# EAGLE design xbee_adapter (EAGLE 5.06)
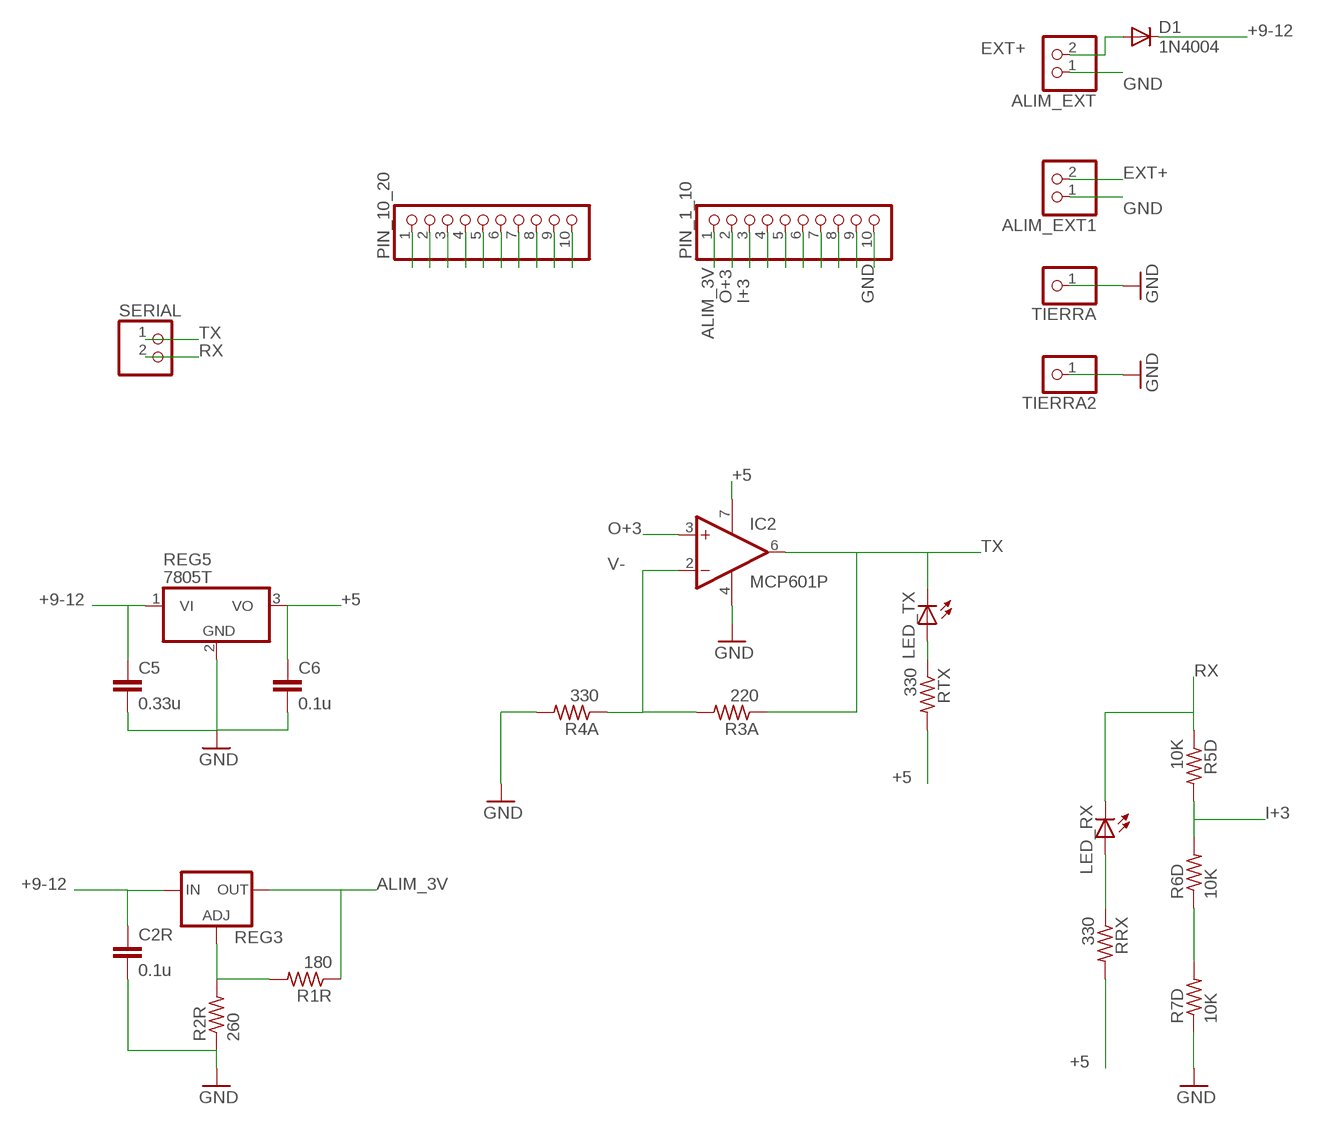
[diagram p0: schematic, sheet 1]

## Parts
ALIM_EXT  PINHD-1X2  [1X02]
ALIM_EXT1  PINHD-1X2  [1X02]
C2R  0.1u  C-EU025-024X044  [C025-024X044]
C5  0.33u  C-EU025-024X044  [C025-024X044]
C6  0.1u  C-EU025-024X044  [C025-024X044]
D1  1N4004  [DO41-10]
IC2  MCP601P  [DIL08]
LED_RX  LED3MM  [LED3MM]
LED_TX  LED3MM  [LED3MM]
PIN_1_10  PINHD-1X10  [1X10]
PIN_10_20  PINHD-1X10  [1X10]
R1R  180  R-US_0207/7  [0207/7]
R2R  260  R-US_0207/7  [0207/7]
R3A  220  R-US_0207/7  [0207/7]
R4A  330  R-US_0207/7  [0207/7]
R5D  10K  R-US_0207/7  [0207/7]
R6D  10K  R-US_0207/7  [0207/7]
R7D  10K  R-US_0207/7  [0207/7]
REG3  LM317TL  [317TL]
REG5  7805T  [TO220H]
RRX  330  R-US_0207/7  [0207/7]
RTX  330  R-US_0207/7  [0207/7]
SERIAL  PINHD-1X2  [1X02]
TIERRA  PINHD-1X1  [1X01]
TIERRA2  PINHD-1X1  [1X01]

## Nets
+5: C6.1 IC2.7(V+) REG5.3(VO) RRX.2 RTX.2
+9-12: C2R.1 C5.1 D1.C REG3.3(IN) REG5.1(VI)
ALIM_3V: PIN_1_10.1 R1R.1 REG3.2(OUT)
EXT+: ALIM_EXT1.2 ALIM_EXT.2 D1.A
GND: ALIM_EXT1.1 ALIM_EXT.1 C2R.2 C5.2 C6.2 IC2.4(V-) PIN_1_10.10 R2R.1 R4A.2 R7D.1 REG5.2(GND) TIERRA2.1 TIERRA.1
I+3: PIN_1_10.3 R5D.2 R6D.2
N$1: PIN_10_20.1
N$2: R1R.2 R2R.2 REG3.1(ADJ)
N$3: PIN_10_20.2
N$4: LED_TX.A RTX.1
N$5: PIN_10_20.3
N$6: R6D.1 R7D.2
N$7: PIN_10_20.4
N$8: PIN_10_20.5
N$9: PIN_10_20.6
N$10: PIN_10_20.7
N$11: PIN_10_20.8
N$12: PIN_10_20.9
N$13: PIN_10_20.10
N$15: LED_RX.A RRX.1
N$17: PIN_1_10.4
N$18: PIN_1_10.5
N$19: PIN_1_10.6
N$20: PIN_1_10.7
N$21: PIN_1_10.8
N$22: PIN_1_10.9
O+3: IC2.3(+IN) PIN_1_10.2
RX: LED_RX.K(C) R5D.1 SERIAL.2
TX: IC2.6(OUT) LED_TX.K(C) R3A.1 SERIAL.1
V-: IC2.2(-IN) R3A.2 R4A.1

## Library data of the parts
ALIM_EXT ALIM_EXT1 SERIAL = pinhead:PINHD-1X2: PIN HEADER
C2R C5 C6 = rcl:C-EU: CAPACITOR, European symbol
D1 = diode:1N4004: DIODE general purpose rectifier, 1 A
IC2 = linear:MCP601: Single Op Amp 2.7V to 6.0V Single Supply CMOS Source: http://ww1.microchip.com/downloads/en/DeviceDoc/21314g.pdf
LED_RX LED_TX = led:LED: LED OSRAM: - CHIPLED LG R971, LG N971, LY N971, LG Q971, LY Q971, LO R971, LY R971 LH N974, LH R974 LS Q976, LO Q976, LY Q976 LO Q996 - Hyper CHIPLED LW Q18S LB Q993, LB Q99A, LB R99A - SideLED LS A670, LO A670, LY A670, LG A670, LP A670 LB A673, LV A673, LT A673, LW A673 LH A674 LY A675 LS A676, LA A676, LO A676, LY A676, LW A676 LS A679, LY A679, LG A679 - Hyper Micro SIDELED® LS Y876, LA Y876, LO Y876, LY Y876 LT Y87S - SmartLED LW L88C, LW L88S LB L89C, LB L89S, LG L890 LS L89K, LO L89K, LY L89K LS L896, LA L896, LO L896, LY L896 - TOPLED LS T670, LO T670, LY T670, LG T670, LP T670 LSG T670, LSP T670, LSY T670, LOP T670, LYG T670 LG T671, LOG T671, LSG T671 LB T673, LV T673, LT T673, LW T673 LH T674 LS T676, LA T676, LO T676, LY T676, LB T676, LH T676, LSB T676, LW T676 LB T67C, LV T67C, LT T67C, LS T67K, LO T67K, LY T67K, LW E67C LS E67B, LA E67B, LO E67B, LY E67B, LB E67C, LV E67C, LT E67C LW T67C LS T679, LY T679, LG T679 LS T770, LO T770, LY T770, LG T770, LP T770 LB T773, LV T773, LT T773, LW T773 LH T774 LS E675, LA E675, LY E675, LS T675 LS T776, LA T776, LO T776, LY T776, LB T776 LHGB T686 LT T68C, LB T68C - Hyper Mini TOPLED® LB M676 - Mini TOPLED Santana® LG M470 LS M47K, LO M47K, LY M47K Source: http://www.osram.convergy.de LUXEON: - LUMILED® LXK2-PW12-R00, LXK2-PW12-S00, LXK2-PW14-U00, LXK2-PW14-V00 LXK2-PM12-R00, LXK2-PM12-S00, LXK2-PM14-U00 LXK2-PE12-Q00, LXK2-PE12-R00, LXK2-PE12-S00, LXK2-PE14-T00, LXK2-PE14-U00 LXK2-PB12-K00, LXK2-PB12-L00, LXK2-PB12-M00, LXK2-PB14-N00, LXK2-PB14-P00, LXK2-PB14-Q00 LXK2-PR12-L00, LXK2-PR12-M00, LXK2-PR14-Q00, LXK2-PR14-R00 LXK2-PD12-Q00, LXK2-PD12-R00, LXK2-PD12-S00 LXK2-PH12-R00, LXK2-PH12-S00 LXK2-PL12-P00, LXK2-PL12-Q00, LXK2-PL12-R00 Source: www.luxeon.com KINGBRIGHT: KA-3528ASYC Source: www.kingbright.com
PIN_1_10 PIN_10_20 = pinhead:PINHD-1X10: PIN HEADER
R1R R2R R3A R4A R5D R6D R7D RRX RTX = rcl:R-US_: RESISTOR, American symbol
REG3 = v-reg:LM317TL: VOLTAGE REGULATOR
REG5 = linear:78*: Positive VOLTAGE REGULATOR Source: http://cache.national.com/ds/LM/LM78L05.pdf http://www.fairchildsemi.com/ds/LM/LM7805.pdf
TIERRA TIERRA2 = pinhead:PINHD-1X1: PIN HEADER

## Board
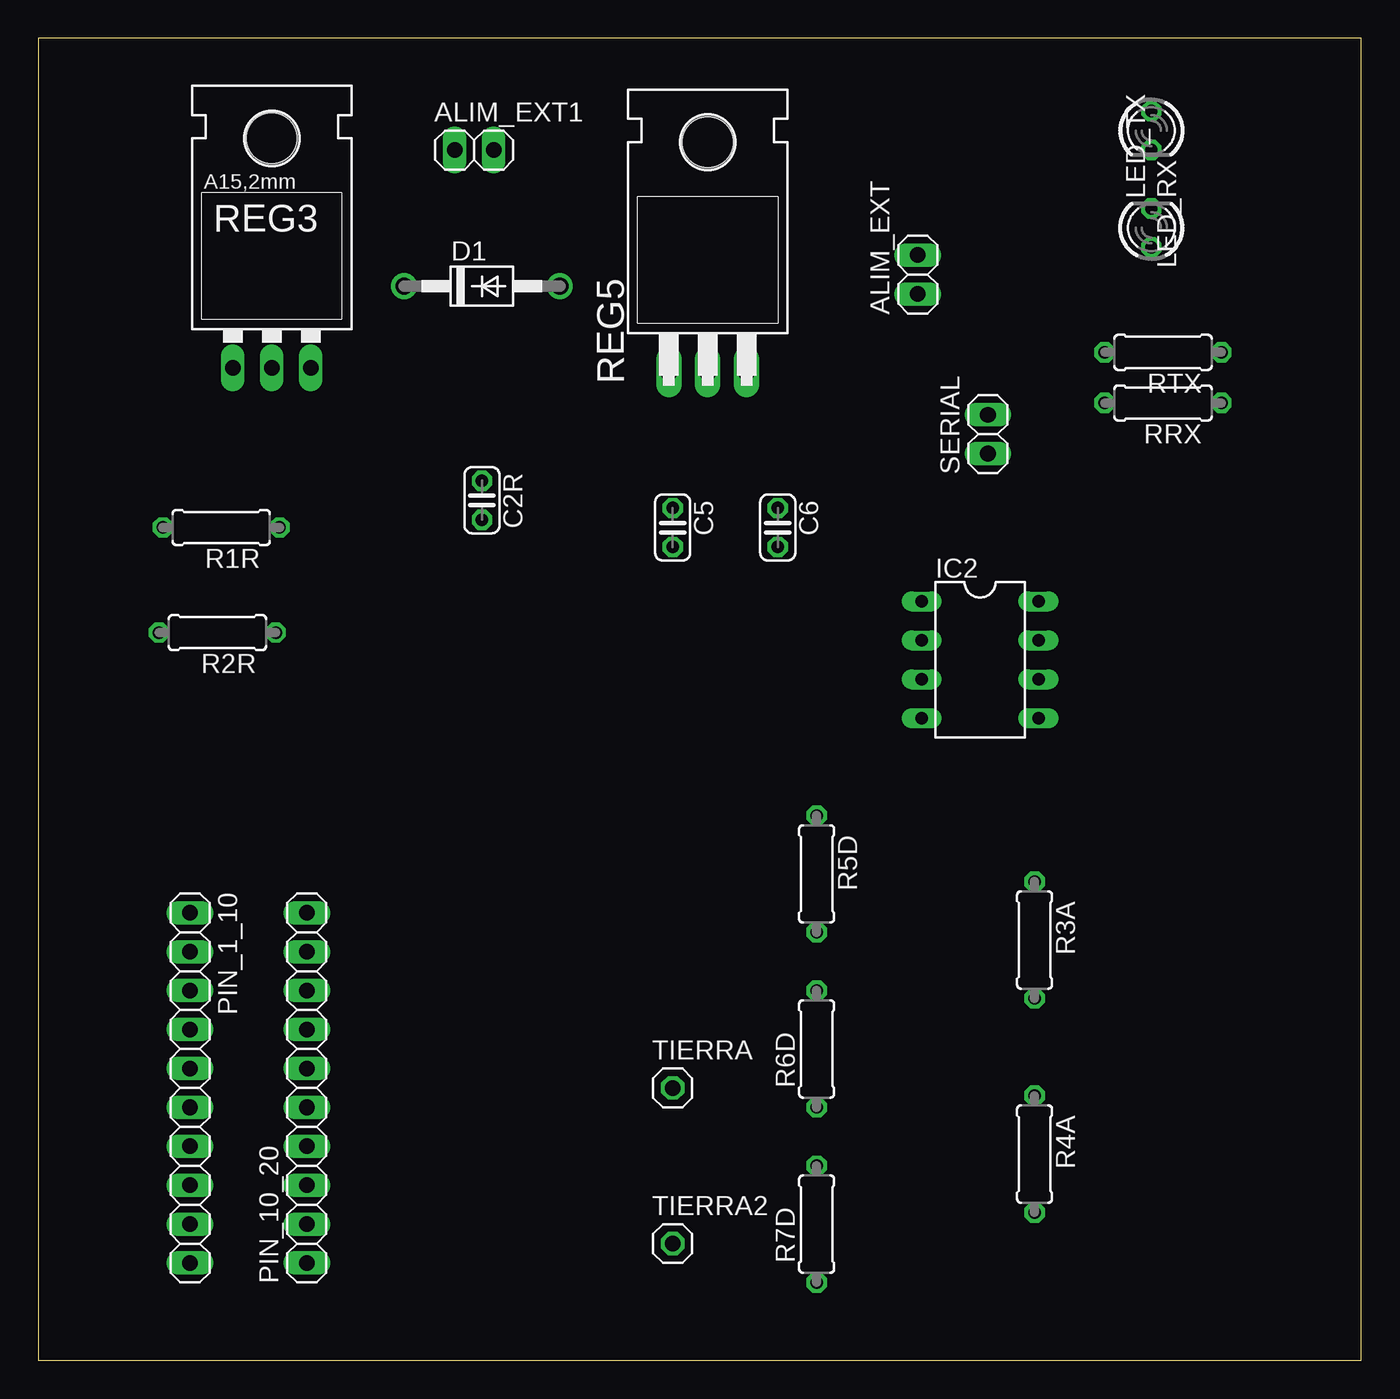
[diagram p1: board, top side]
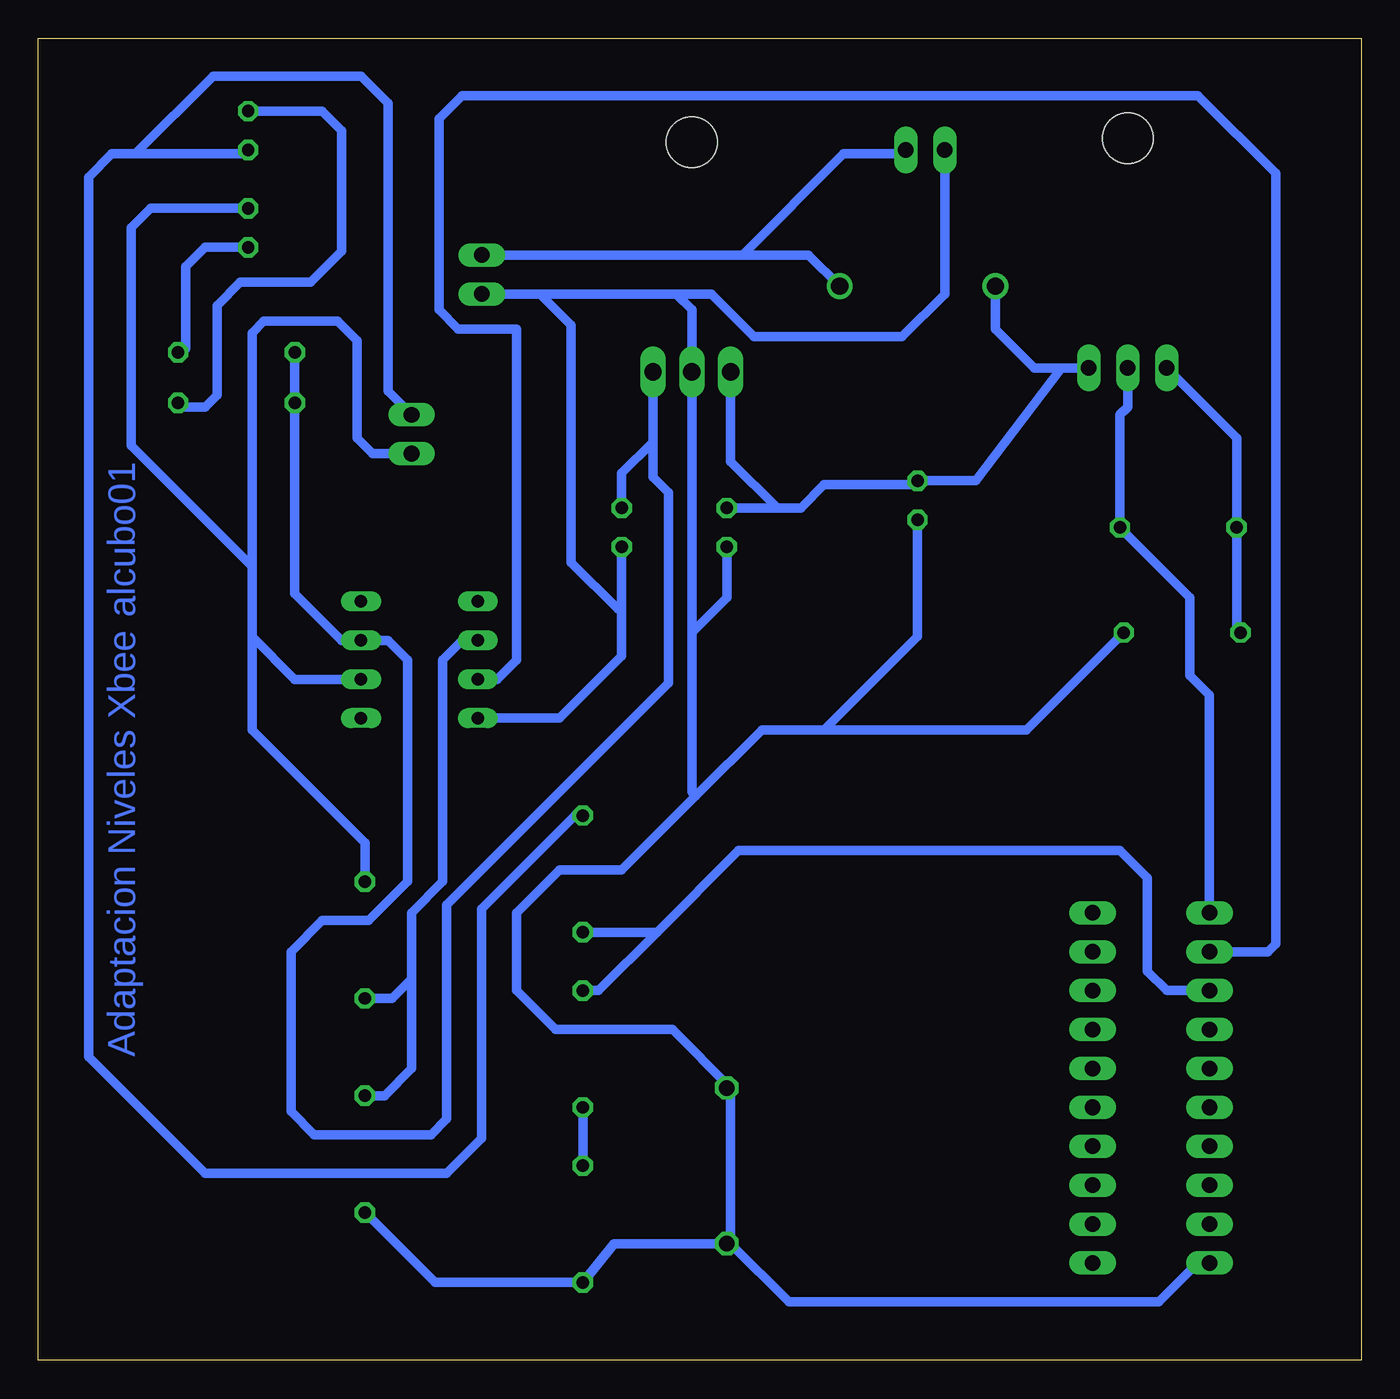
[diagram p2: board, bottom side, seen from below]

Size 86.34 x 86.28 mm. Coordinates in mm from the lower left corner, seen from the top.
Outline: 0,0 86.34,0 86.34,86.28 0,86.28 0,0
Copper layers (1*16): Top 0.035mm / dielectric 1.5mm / Bottom 0.035mm
Design rules "default *": minimum track width 24mil, minimum drill 24mil, track to track 20mil, track to pad 20mil, pad to pad 8mil, via to via 8mil, smd to smd 8mil, copper to edge 40mil, drill to drill 8mil, minimum pad ring 10mil, minimum via ring 8mil, stop-mask expansion 4mil, vias tented up to drill 0mil, thermal gap 10mil
bRestrict: area 16.3,27.4 to 19,28.4; area 27.9,55.6 to 30,56.6; area 40.4,53.8 to 42.4,54.9; area 47.2,53.8 to 49.3,54.9; area 16.3,24.9 to 19,25.9; area 16.3,22.4 to 19,23.4; area 16.3,19.8 to 19,20.8; area 16.3,17.3 to 19,18.3; area 16.3,14.7 to 19,15.7; area 16.3,12.2 to 19,13.2; area 16.3,9.7 to 19,10.7; area 8.6,27.4 to 11.4,28.4; 21 more areas

### Footprints (pad centres in the part's own frame; a part is rotated, then mirrored left to right if it is on the bottom)
1X02 = drill 1.016 long: 1 -1.27,0; 2 1.27,0
C025-024X044 = drill 0.813 octagon: 1 -1.27,0; 2 1.27,0
DO41-10 = drill 1.118 round: A 5.08,0; C -5.08,0
DIL08 = drill 0.813 long: 1 -3.81,-3.81; 2 -1.27,-3.81; 3 1.27,-3.81; 4 3.81,-3.81; 5 3.81,3.81; 6 1.27,3.81; 7 -1.27,3.81; 8 -3.81,3.81
LED3MM = drill 0.813 octagon: A -1.27,0; K 1.27,0
1X10 = drill 1.016 long: 1 -11.43,0; 2 -8.89,0; 3 -6.35,0; 4 -3.81,0; 5 -1.27,0; 6 1.27,0; 7 3.81,0; 8 6.35,0; 9 8.89,0; 10 11.43,0
0207/7 = drill 0.813 octagon: 1 -3.81,0; 2 3.81,0
317TL = drill 1.016 long: 1 -2.54,-3.81; 2 0,-3.81; 3 2.54,-3.81 | hole 3.302: 0,11.176
TO220H = drill 1.118 long: 1 -2.54,-10.16; 2 0,-10.16; 3 2.54,-10.16 | hole 3.302: 0,4.826
1X01 = drill 1.016 octagon: 1 0,0

### Placement (x,y rotation side)
ALIM_EXT  57.4,70.87 90 top
ALIM_EXT1  28.45,78.99 0 top
C2R  28.96,56.13 270 top
C5  41.4,54.36 270 top
C6  48.26,54.36 270 top
D1  28.96,70.1 0 top
IC2  61.47,45.72 270 top
LED_RX  72.64,80.26 270 top
LED_TX  72.64,73.91 90 top
PIN_1_10  9.91,17.78 270 top
PIN_10_20  17.53,17.78 90 top
R1R  11.94,54.36 180 top
R2R  11.68,47.5 180 top
R3A  65.02,27.43 270 top
R4A  65.02,13.46 270 top
R5D  50.8,31.75 270 top
R6D  50.8,20.32 90 top
R7D  50.8,8.89 90 top
REG3  15.24,68.58 0 top
REG5  43.69,74.68 0 top
RRX  73.41,62.48 180 top
RTX  73.41,65.79 180 top
SERIAL  61.98,60.45 90 top
TIERRA  41.4,17.78 0 top
TIERRA2  41.4,7.62 0 top

### Tracks (layer width: path | path; a pad name or v marks a point on that pad's centre or on a via)
+5
  Bottom 0.61: 46.23,59.94 REG5.3 | C6.1 48.26,57.91 46.23,59.94 | 46.23,59.94 46.23,57.66 45.21,56.64 45.21,44.2 59.69,29.72 59.69,15.75 60.71,14.73 68.33,14.73 69.85,16.26 69.85,26.67 67.82,28.7 64.77,28.7 62.23,31.24 62.23,45.72 63.5,46.99 IC2.7 66.55,46.99 69.6,50.04 RRX.2 RTX.2
+9-12
  Bottom 0.61: REG3.3 19.56,64.77 | 19.56,64.77 21.34,64.77 23.88,67.31 D1.C | 19.56,64.77 25.15,57.4 C2R.1 29.21,57.15 35.05,57.15 36.58,55.63 38.1,55.63 | 41.15,55.88 C5.1 38.1,55.63 | REG5.1 41.15,58.67 38.1,55.63
ALIM_3V
  Bottom 0.61: REG3.2 15.24,62.23 15.75,61.72 R1R.1 11.18,49.78 11.18,44.7 9.91,43.43 PIN_1_10.1
EXT+
  Bottom 0.61: 40.39,72.14 36.07,72.14 D1.A | 40.39,72.14 ALIM_EXT.2 | 40.39,72.14 33.78,78.74 29.97,78.74 ALIM_EXT1.2
GND
  Bottom 0.61: 44.7,69.6 43.69,68.58 REG5.2 43.69,47.5 | 44.7,69.6 53.59,69.6 | 53.59,69.6 ALIM_EXT.1 | 48.26,49.02 48.26,45.97 52.32,41.91 IC2.4 | 41.15,7.62 37.34,3.81 13.21,3.81 10.67,6.35 PIN_1_10.10 | 41.15,7.62 41.15,17.78 | 41.15,7.62 TIERRA2.1 48.77,7.62 R7D.1 60.45,5.08 R4A.2 | 41.15,17.78 44.96,21.59 52.58,21.59 55.12,24.13 55.12,29.21 52.32,32 48.26,32 43.43,36.83 | 41.15,17.78 TIERRA.1 | 48.26,49.02 C6.2 | 48.26,49.02 48.51,49.02 51.56,52.07 51.56,67.56 53.59,69.6 | ALIM_EXT1.1 27.18,69.6 29.97,66.8 39.62,66.8 42.42,69.6 44.7,69.6 | 43.43,36.83 39.12,41.15 35.05,41.15 | 35.05,41.15 21.84,41.15 R2R.1 | C2R.2 28.96,47.24 35.05,41.15 | 43.69,47.5 43.69,37.08 43.43,36.83 | C5.2 41.4,49.78 43.69,47.5
I+3
  Bottom 0.61: PIN_1_10.3 12.7,24.13 13.97,25.4 13.97,31.5 15.75,33.27 40.64,33.27 45.97,27.94 | 45.97,27.94 R5D.2 | R6D.2 49.78,24.13 45.97,27.94
N$2
  Bottom 0.61: REG3.1 8.13,60.2 R1R.2 8.13,47.75 R2R.2
N$4
  Bottom 0.61: RTX.1 76.71,66.04 76.71,71.37 75.44,72.64 LED_TX.A 72.9,72.39
N$6
  Bottom 0.61: R7D.2 R6D.1
N$15
  Bottom 0.61: RRX.1 76.71,62.23 75.44,62.23 74.68,62.99 74.68,68.83 73.15,70.36 68.58,70.36 66.55,72.39 66.55,80.26 67.82,81.53 LED_RX.A 72.9,81.28
O+3
  Bottom 0.61: IC2.3 56.39,44.45 55.12,45.72 55.12,67.31 58.93,67.31 60.2,68.58 60.2,81.03 58.67,82.55 10.67,82.55 5.59,77.47 5.59,60.45 | 5.59,60.45 5.59,27.18 6.1,26.67 PIN_1_10.2 | 5.59,60.45 5.59,60.96
RX
  Bottom 0.61: R5D.1 51.31,35.56 57.4,29.46 57.4,14.48 59.69,12.19 75.44,12.19 83.06,19.81 83.06,30.73 | LED_RX.K 72.9,78.74 80.01,78.74 | SERIAL.2 63.5,63.25 63.5,82.04 65.28,83.82 74.93,83.82 80.01,78.74 | 80.01,78.74 81.53,78.74 83.06,77.22 83.06,30.73 | 83.06,30.73 83.06,30.48
TX
  Bottom 0.61: SERIAL.1 64.52,59.18 65.53,60.2 65.53,66.55 66.8,67.82 71.63,67.82 72.39,67.06 72.39,55.88 | 72.39,55.88 72.39,55.37 | IC2.6 69.6,44.45 72.39,47.24 72.39,47.5 | 72.39,47.5 72.39,51.82 | 72.39,51.82 72.39,55.88 | R3A.1 65.02,33.78 72.39,41.15 72.39,47.5 | LED_TX.K 78.99,75.18 80.26,73.91 80.26,59.69 72.39,51.82
V-
  Bottom 0.61: IC2.2 58.67,46.99 59.94,45.72 59.94,31.24 61.98,29.21 61.98,25.15 | 61.98,25.15 61.98,24.89 63.25,23.62 R3A.2 | R4A.1 63.75,17.27 61.98,19.05 61.98,25.15

### Text on the board
Bottom: alcubo01 | Adaptacion Niveles Xbee